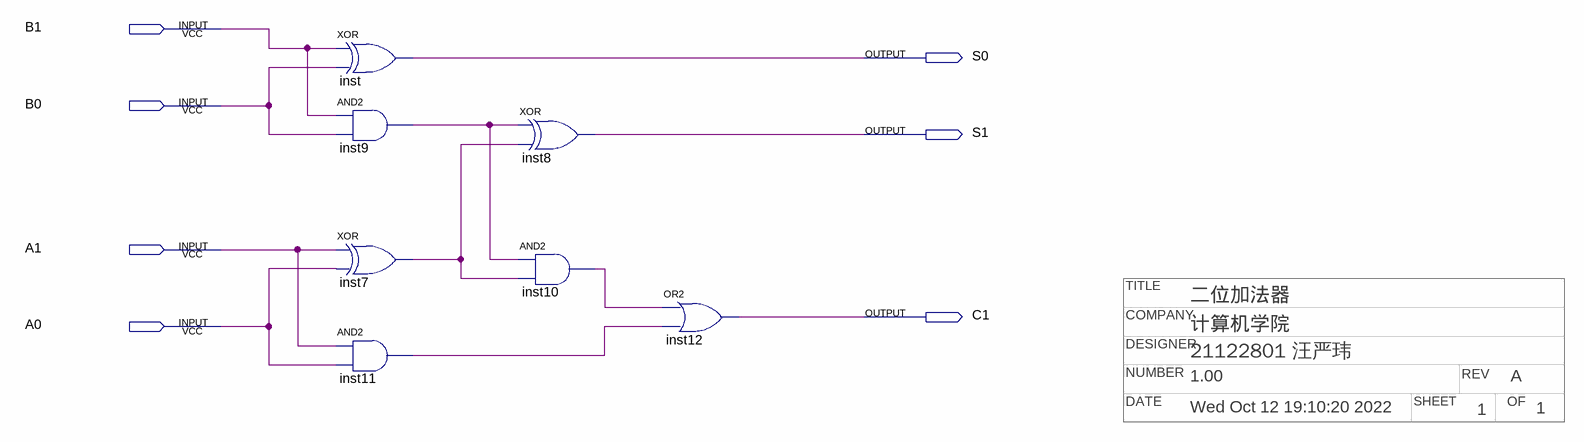
[diagram p0: schematic sheet]
// Quartus schematic ex2.bdf as structural Verilog: 7 symbols, 7 pins
// Title block: TITLE: 二位加法器; COMPANY: 计算机学院; DESIGNER: 21122801 汪严玮; NUMBER: 1.00; REV: A; DATE: Wed Oct 12 19:10:20 2022; SHEET: 1; OF: 1
module ex2 (
  input  B1,
  input  B0,
  input  A1,
  input  A0,
  output S0,
  output S1,
  output C1
);

  wire inst7_out, inst9_out, inst10_out, inst11_out;

  xor inst (S0, B1, B0);
  and inst9 (inst9_out, B1, B0);
  xor inst7 (inst7_out, A1, A0);
  and inst11 (inst11_out, A1, A0);
  xor inst8 (S1, inst9_out, inst7_out);
  and inst10 (inst10_out, inst9_out, inst7_out);
  or inst12 (C1, inst10_out, inst11_out);
endmodule
